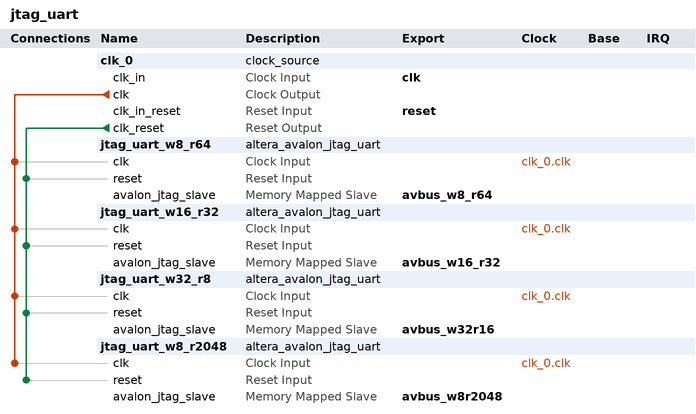
[diagram p0: system contents]
# Platform Designer (Qsys) system jtag_uart, Cyclone II EP2C5T144C8
# Parameters at their usual value, and those the tool derives, are not listed.
package require -exact qsys 13.0.1.99.2
create_system jtag_uart
set_project_property DEVICE_FAMILY {Cyclone II}
set_project_property DEVICE EP2C5T144C8

add_instance clk_0 clock_source 13.0
set_instance_parameter_value clk_0 clockFrequency 50000000

add_instance jtag_uart_w8_r64 altera_avalon_jtag_uart 13.0.1.99.2
set_instance_parameter_value jtag_uart_w8_r64 readIRQThreshold 4
set_instance_parameter_value jtag_uart_w8_r64 simInteractiveOptions NO_INTERACTIVE_WINDOWS
set_instance_parameter_value jtag_uart_w8_r64 writeBufferDepth 8
set_instance_parameter_value jtag_uart_w8_r64 writeIRQThreshold 4

add_instance jtag_uart_w16_r32 altera_avalon_jtag_uart 13.0.1.99.2
set_instance_parameter_value jtag_uart_w16_r32 readBufferDepth 32
set_instance_parameter_value jtag_uart_w16_r32 simInteractiveOptions NO_INTERACTIVE_WINDOWS
set_instance_parameter_value jtag_uart_w16_r32 writeBufferDepth 16

add_instance jtag_uart_w32_r8 altera_avalon_jtag_uart 13.0.1.99.2
set_instance_parameter_value jtag_uart_w32_r8 readBufferDepth 8
set_instance_parameter_value jtag_uart_w32_r8 readIRQThreshold 2
set_instance_parameter_value jtag_uart_w32_r8 simInteractiveOptions NO_INTERACTIVE_WINDOWS
set_instance_parameter_value jtag_uart_w32_r8 writeBufferDepth 32
set_instance_parameter_value jtag_uart_w32_r8 writeIRQThreshold 16

add_instance jtag_uart_w8_r2048 altera_avalon_jtag_uart 13.0.1.99.2
set_instance_parameter_value jtag_uart_w8_r2048 readBufferDepth 2048
set_instance_parameter_value jtag_uart_w8_r2048 simInteractiveOptions NO_INTERACTIVE_WINDOWS
set_instance_parameter_value jtag_uart_w8_r2048 writeBufferDepth 8
set_instance_parameter_value jtag_uart_w8_r2048 writeIRQThreshold 2

# connections
add_connection clk_0.clk jtag_uart_w8_r64.clk clock
add_connection clk_0.clk jtag_uart_w8_r2048.clk clock
add_connection clk_0.clk jtag_uart_w16_r32.clk clock
add_connection clk_0.clk jtag_uart_w32_r8.clk clock
add_connection clk_0.clk_reset jtag_uart_w8_r64.reset reset
add_connection clk_0.clk_reset jtag_uart_w8_r2048.reset reset
add_connection clk_0.clk_reset jtag_uart_w16_r32.reset reset
add_connection clk_0.clk_reset jtag_uart_w32_r8.reset reset

# exported interfaces
add_interface clk clock sink
set_interface_property clk EXPORT_OF clk_0.clk_in
add_interface reset reset sink
set_interface_property reset EXPORT_OF clk_0.clk_in_reset
add_interface avbus_w8_r64 avalon slave
set_interface_property avbus_w8_r64 EXPORT_OF jtag_uart_w8_r64.avalon_jtag_slave
add_interface avbus_w16_r32 avalon slave
set_interface_property avbus_w16_r32 EXPORT_OF jtag_uart_w16_r32.avalon_jtag_slave
add_interface avbus_w32r16 avalon slave
set_interface_property avbus_w32r16 EXPORT_OF jtag_uart_w32_r8.avalon_jtag_slave
add_interface avbus_w8r2048 avalon slave
set_interface_property avbus_w8r2048 EXPORT_OF jtag_uart_w8_r2048.avalon_jtag_slave

set_interconnect_requirement {$system} qsys_mm.clockCrossingAdapter HANDSHAKE
set_interconnect_requirement {$system} qsys_mm.maxAdditionalLatency 1

save_system jtag_uart.qsys
